# Altium project F4DroneFlightController.PrjPcb
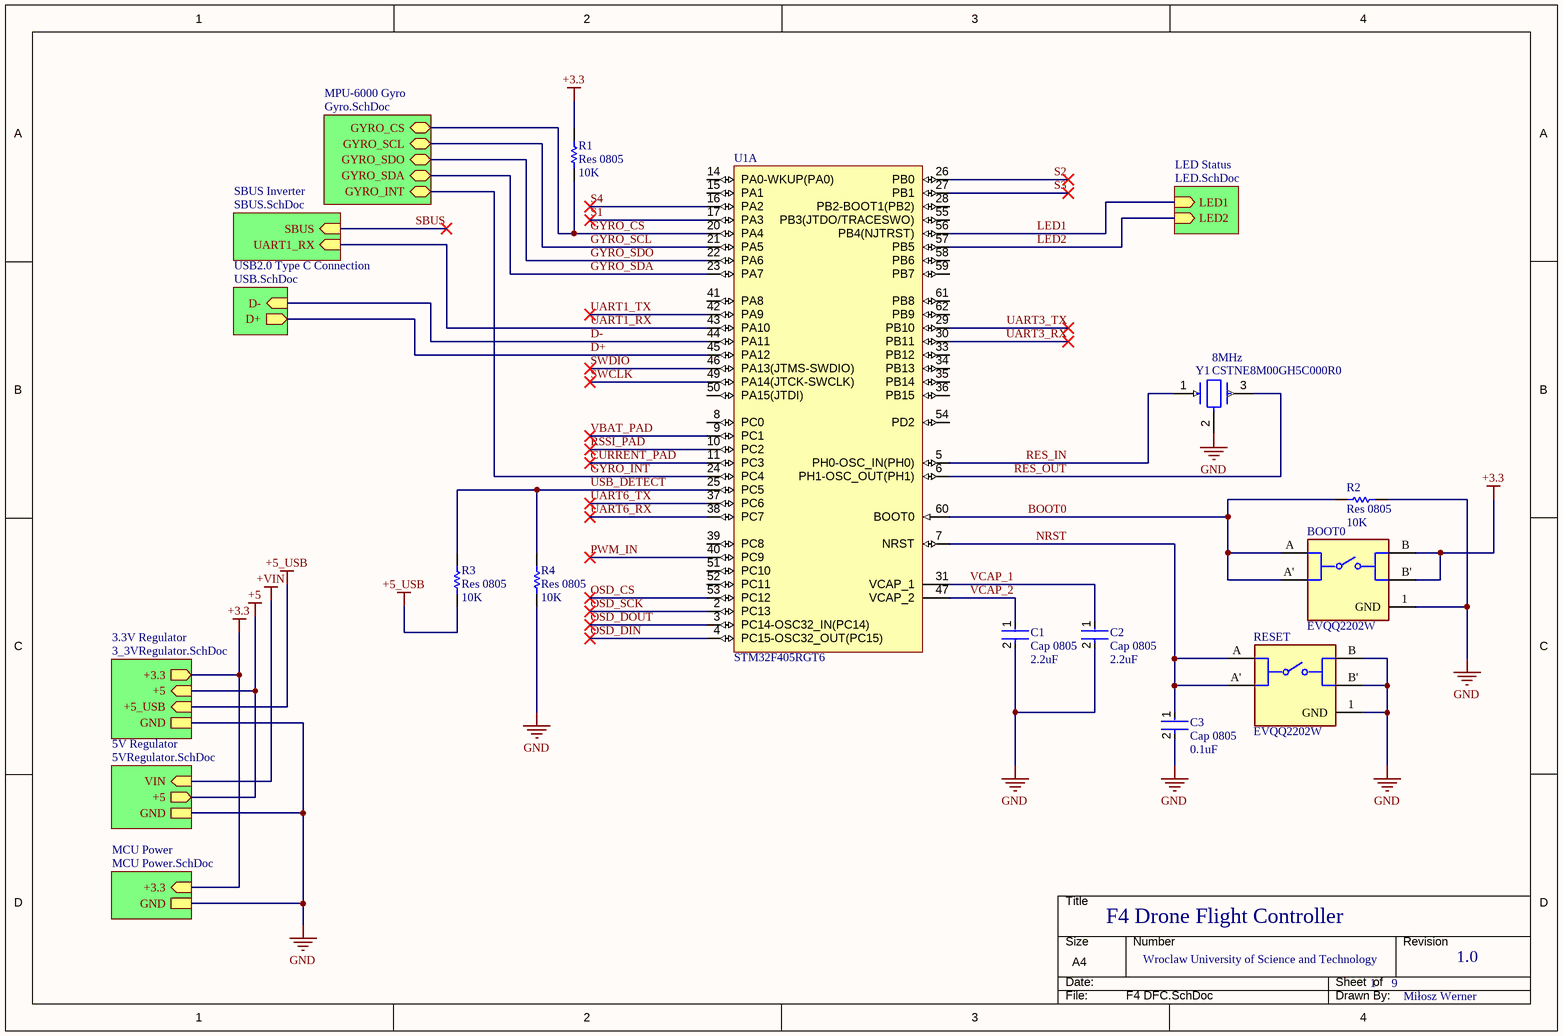
[diagram p0: F4 DFC.SchDoc]
9 sheets, 43 parts. Net scope: hierarchical (ports join the sheet entries above them; power ports are global).
Board file: PCB.PcbDoc
Sheets:
  F4 DFC.SchDoc
    MPU-6000 Gyro = Gyro.SchDoc
    LED Status = LED.SchDoc
    SBUS Inverter = SBUS.SchDoc
    USB2.0 Type C Connection = USB.SchDoc
    3.3V Regulator = 3_3VRegulator.SchDoc
    MCU Power = MCU Power.SchDoc
    5V Regulator = 5VRegulator.SchDoc
  SWD.SchDoc

## Sheet F4 DFC.SchDoc: F4 Drone Flight Controller
size A4; Author: Miłosz Werner & Julia Rzepka; DrawnBy: Miłosz Werner; Organization: Wroclaw University of Science and Technology; DocumentNumber: 1; Revision: 1.0; SheetNumber: 1; SheetTotal: 9

### Parts
BOOT0  EVQQ2202W  [FP-EVQQ2202W-MFG]
C1  Cap 0805  value 2.2uF  [FP-GRM216-0_1-IPC_C]
C2  Cap 0805  value 2.2uF  [FP-GRM216-0_1-IPC_C]
C3  Cap 0805  value 0.1uF  [FP-GRM216-0_1-IPC_C]
R1  Res 0805  value 10K  [RESC2013X50X30LL20T20]
R2  Res 0805  value 10K  [RESC2013X50X30LL20T20]
R3  Res 0805  value 10K  [RESC2013X50X30LL20T20]
R4  Res 0805  value 10K  [RESC2013X50X30LL20T20]
RESET  EVQQ2202W  [FP-EVQQ2202W-MFG]
U1  STM32F405RGT6  [STM-LQFP64_V]  (part A of 2)
Y1  CSTNE8M00GH5C000R0  value 8MHz  [FP-CSTNE8M00GH5C000R0-MFG]

### Sub-sheets
3.3V Regulator = 3_3VRegulator.SchDoc: +3.3 (out), +5 (in), +5_USB (in), GND
5V Regulator = 5VRegulator.SchDoc: VIN (in), +5 (out), GND
LED Status = LED.SchDoc: LED1 (in), LED2 (in)
MCU Power = MCU Power.SchDoc: +3.3 (in), GND
MPU-6000 Gyro = Gyro.SchDoc: GYRO_SDO (bidir), GYRO_SCL (bidir), GYRO_CS (bidir), GYRO_SDA (bidir), GYRO_INT (bidir)
SBUS Inverter = SBUS.SchDoc: UART1_RX (in), SBUS (in)
USB2.0 Type C Connection = USB.SchDoc: D- (in), D+ (out)

### Nets
+3.3: BOOT0.B BOOT0.B' R1.2 ; sheet 3.3V Regulator/+3.3, sheet MCU Power/+3.3
+5: sheet 3.3V Regulator/+5, sheet 5V Regulator/+5
+5_USB: R3.1 ; sheet 3.3V Regulator/+5_USB
+VIN: sheet 5V Regulator/VIN
GND: BOOT0.1(GND) C1.2 C2.2 C3.2 R2.1 R4.1 RESET.1(GND) RESET.B RESET.B' Y1.2(GND) ; sheet 3.3V Regulator/GND, sheet MCU Power/GND, sheet 5V Regulator/GND
BOOT0: BOOT0.A BOOT0.A' R2.2 U1.60(BOOT0)
CURRENT_PAD: U1.11(PC3)
D+: U1.45(PA12) ; sheet USB2.0 Type C Connection/D+
D-: U1.44(PA11) ; sheet USB2.0 Type C Connection/D-
GYRO_CS: R1.1 U1.20(PA4) ; sheet MPU-6000 Gyro/GYRO_CS
GYRO_INT: U1.24(PC4) ; sheet MPU-6000 Gyro/GYRO_INT
GYRO_SCL: U1.21(PA5) ; sheet MPU-6000 Gyro/GYRO_SCL
GYRO_SDA: U1.23(PA7) ; sheet MPU-6000 Gyro/GYRO_SDA
GYRO_SDO: U1.22(PA6) ; sheet MPU-6000 Gyro/GYRO_SDO
LED1: U1.56(PB4(NJTRST)) ; sheet LED Status/LED1
LED2: U1.57(PB5) ; sheet LED Status/LED2
NRST: C3.1 RESET.A RESET.A' U1.7(NRST)
OSD_CS: U1.53(PC12)
OSD_DIN: U1.4(PC15-OSC32_OUT(PC15))
OSD_DOUT: U1.3(PC14-OSC32_IN(PC14))
OSD_SCK: U1.2(PC13)
PWM_IN: U1.40(PC9)
RES_IN: U1.5(PH0-OSC_IN(PH0)) Y1.1(Input)
RES_OUT: U1.6(PH1-OSC_OUT(PH1)) Y1.3(Output)
RSSI_PAD: U1.10(PC2)
S1: U1.17(PA3)
S2: U1.26(PB0)
S3: U1.27(PB1)
S4: U1.16(PA2)
SWCLK: U1.49(PA14(JTCK-SWCLK))
SWDIO: U1.46(PA13(JTMS-SWDIO))
UART1_RX: U1.43(PA10) ; sheet SBUS Inverter/UART1_RX
UART1_TX: U1.42(PA9)
UART3_RX: U1.30(PB11)
UART3_TX: U1.29(PB10)
UART6_RX: U1.38(PC7)
UART6_TX: U1.37(PC6)
USB_DETECT: R3.2 R4.2 U1.25(PC5)
VBAT_PAD: U1.9(PC1)
VCAP_1: C2.1 U1.31(VCAP_1)
VCAP_2: C1.1 U1.47(VCAP_2)

Not connected (* = marked no-connect by the designer): U1 8(PC0) 14(PA0-WKUP(PA0)) 15(PA1) 28(PB2-BOOT1(PB2)) 33(PB12) 34(PB13) 35(PB14) 36(PB15) 39(PC8) 41(PA8) 50(PA15(JTDI)) 51(PC10) 52(PC11) 54(PD2) 55(PB3(JTDO/TRACESWO)) 58(PB6) 59(PB7) 61(PB8) 62(PB9)

### Notes on the sheet
- DWG. NO.
- REV.
- SHT.
- REVISION
- DESCRIPTION
- DATE
- APPROVED
- THIS DOCUMENT AND THE DATA DISCLOSED HEREIN OR HEREWITH IS THE PROPERTY OF ALTIUM LIMITED AND MAY BE FREELY DISTRIBUTED IN WHOLE. NO RIGHTS ARE RESERVED OR EXPRESS OR IMPLIED WARANTEE GIVEN.
- ENG:
- DSN:
- APPROVALS
- PROJECT
- DOCUMENT REVISION:
- DESIGN ITEM:
- CHK:
- BOM:
- REFERENCE DOCUMENTS
- PROJECT REVISION:
- TITLE
- FAB DWG:
- PCB DWG:
- ASSY DWG:
- SCALE:
- SIZE
- C
- CAGE CODE
- FILE NAME
- DWG NO.
- SHEET
- OF
- REV

### Library data of the parts
BOOT0 RESET = CMP-05618-000131-1: SWITCH TACTILE SPST-NO 0.02A 15V; Mechanical Life: 100000Cycles; Actuator Length: 0.7mm; Operating Force: 3.5N; Contact Current Rating: 20mA; Actuator Type: Standard; Illumination Type: Non-Illuminated; Contact Resistance: 100mR; Switch Travel: 0.25mm; Actuator Color: White; Voltage Rating (AC): 250V; Body Depth: 6mm; Throw Configuration: SPST; Switch Function: Off-Mom; REACH SVHC: No SVHC; RoHS Compliant: Yes; Color: White; Radiation Hardening: No; Series: EVQQ2; Max Operating Temperature: 85°C; Thickness: 1.8mm; Lead Free: Lead Free; Electrical Life: 100000Cycles; Packaging: Tape and Reel; Max Voltage Rating (DC): 15V; Contact Plating: Silver; Length: 6mm; Mount: Surface Mount; Depth: 6.6mm; Current Rating: 20mA; Min Operating Temperature: -40°C; Voltage Rating (DC): 15V; Size: 1.8mm; Termination: SMD/SMT; Case/Package: SMD/SMT; Max Voltage Rating (AC): 250V; Orientation: Straight; Package Quantity: 1; Max Current Rating: 20mA
C1-C3 = CMP-2007-00889-2: Capacitor; Capacitance: 100nF; Mount: Surface Mount; Case/Package: 0805; Case Code (Imperial): 0805
R1-R4 = CMP-2001-03735-1: Resistor
U1 = CMP-0243-00019-3: ARM Cortex-M4 32-bit MCU+FPU, 210 DMIPS, 1024 kB Flash, 192 kB Internal RAM, 51 I/Os, 64-pin LQFP, -40 to 85 degC, Tray; Manufacturer: STMicroelectronics; Supply Voltage(Vcc) min (V): 1.8; Supply Voltage(Vcc) max (V): 3.6; Internal RAM Size (kB): 192; I/Os (High Current): 51; D/A Converter: 2x12-bit; FLASH Size (Prog) (kB): 1024; Operating Frequency(F) (Processor speed) (MHz): 168; ComponentLink2Description: Datasheet; PackageVersion: Rev. 4, 06/2013; DatasheetVersion: Rev. 4; Core: ARM Cortex-M4; ComponentLink2URL: http://www.st.com/st-web-ui/static/active/en/resource/technical/document/datasheet/DM00037051.pdf; PackageReference: LQFP64; Packing: Tray; ComponentLink1Description: Manufacturer URL; ComponentLink3URL: http://www.st.com/st-web-ui/static/active/en/resource/technical/document/datasheet/DM00037051.pdf; ComponentLink3Description: Package Specification; Mounting Technology: Surface Mount; ComponentLink1URL: http://www.st.com/web/en/home.html; PackageDescription: 64-Pin Low Profile Quad Flat Package, 10 x 10 mm Body, 0.5 mm Pitch; PartNumber: STM32F405RGT6
Y1 = CMP-06057-000001-1: CERAMIC RES 8.0000MHZ 33PF SMD; Frequency Stability: 0.13%; Frequency Tolerance: 0.07%; Impedance: 40R; Mount: Surface Mount; Min Operating Temperature: -40°C; Max Operating Temperature: 125°C; Resistor Type: Ceramic; Capacitance: 33pF; Packaging: Tape and Reel; Frequency: 8MHz; Case/Package: SMD/SMT

## Sheet Gyro.SchDoc: MPU-6000 Gyro
size A4; Author: Miłosz Werner & Julia Rzepka; DrawnBy: Miłosz Werner; Organization: Wroclaw University of Science and Technology; DocumentNumber: 1; Revision: 1.0; SheetNumber: 2; SheetTotal: 9
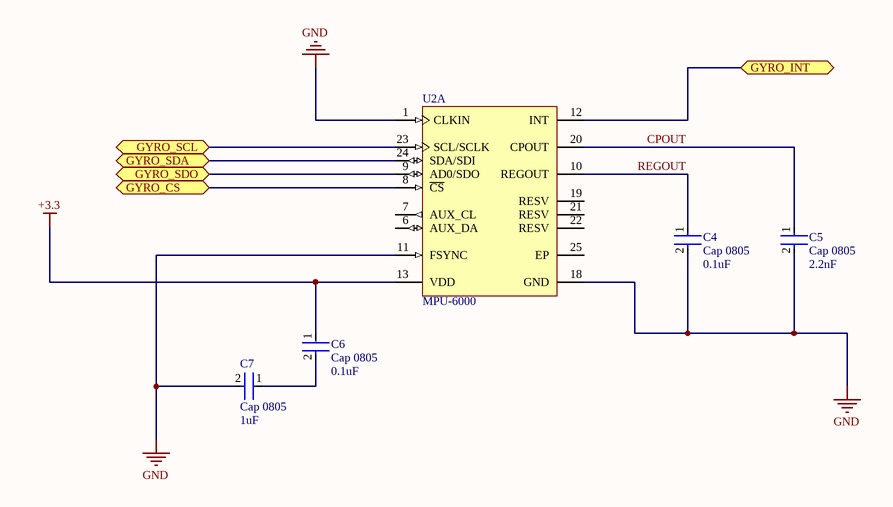
[diagram p1: Gyro.SchDoc]

### Parts
C4  Cap 0805  value 0.1uF  [FP-GRM216-0_1-IPC_C]
C5  Cap 0805  value 2.2nF  [FP-GRM216-0_1-IPC_C]
C6  Cap 0805  value 0.1uF  [FP-GRM216-0_1-IPC_C]
C7  Cap 0805  value 1uF  [FP-GRM216-0_1-IPC_C]
U2  MPU-6000  [INSE-QFN-24_V]  (part A of 2)

### Ports
GYRO_CS (bidir), GYRO_INT (bidir), GYRO_SCL (bidir), GYRO_SDA (bidir), GYRO_SDO (bidir)

### Nets
+3.3: C6.1 U2.13(VDD)
GND: C4.2 C5.2 C7.2 U2.1(CLKIN) U2.11(FSYNC) U2.18(GND)
CPOUT: C5.1 U2.20(CPOUT)
GYRO_CS: U2.8(~{CS}) ; port GYRO_CS
GYRO_INT: U2.12(INT) ; port GYRO_INT
GYRO_SCL: U2.23(SCL/SCLK) ; port GYRO_SCL
GYRO_SDA: U2.24(SDA/SDI) ; port GYRO_SDA
GYRO_SDO: U2.9(AD0/SDO) ; port GYRO_SDO
REGOUT: C4.1 U2.10(REGOUT)
NetC6_2: C6.2 C7.1

Not connected (* = marked no-connect by the designer): U2 6(AUX_DA) 7(AUX_CL) 19(RESV) 21(RESV) 22(RESV) 25(EP)

### Library data of the parts
C4-C7 = CMP-2007-00889-2: Capacitor; Capacitance: 100nF; Mount: Surface Mount; Case/Package: 0805; Case Code (Imperial): 0805
U2 = CMP-2000-05008-1: 3-Axis Gyroscope 3-Axis Accelerometer Motion Processing Unit with I2C and SPI, 2.5, 3 or 3.3 V, -40 to 85 degC, 24-Pin QFN, RoHS, Tape and Reel; Manufacturer: InvenSense; Featured Product: MPU60006AxisIntegratedSPISolution; Output Type: I²C,SPI; Sensor Type: Accelerometer,Gyroscope,3Axis; Other Names: 1428-1005-2 / MPU6000; Online Catalog: MPU-6000™Series; Operating Temperature: -40degC~85degC(TA); Datasheet URL: https://www.invensense.com/wp-content/uploads/2015/02/MPU-6000-Datasheet1.pdf; Manufacturer URL: http://www.invensense.com/; Datasheet Version: Rev. 3.4, 08/2013; Standard Package: 5,000; Family: Multifunction; Package Reference: QFN-24; Category: Sensors,Transducers; Package Description: 24-Pin Quad Flat No-lead Package, Body 4 x 4 mm, Pitch 0.5 mm

## Sheet LED.SchDoc: LED Status
size A4; Author: Miłosz Werner & Julia Rzepka; DrawnBy: Miłosz Werner; Organization: Wroclaw University of Science and Technology; Revision: 1.0; SheetNumber: 6; SheetTotal: 8
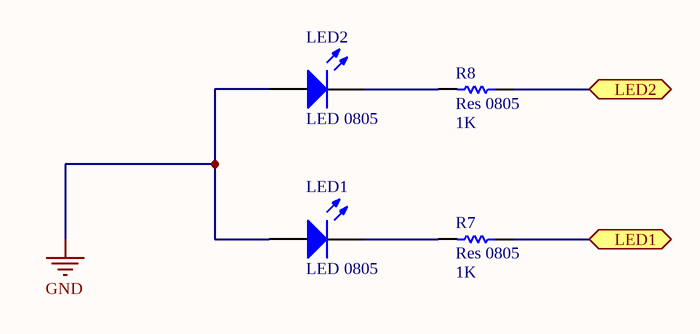
[diagram p2: LED.SchDoc]

### Parts
LED1  LED 0805  [0805_A]
LED2  LED 0805  [0805_A]
R7  Res 0805  value 1K  [RESC2013X50X30LL20T20]
R8  Res 0805  value 1K  [RESC2013X50X30LL20T20]

### Ports
LED1 (bidir), LED2 (bidir)

### Nets
GND: LED1.2(A) LED2.2(A)
LED1: R7.1 ; port LED1
LED2: R8.1 ; port LED2
NetLED1_1: LED1.1(K) R7.2
NetLED2_1: LED2.1(K) R8.2

### Library data of the parts
LED1 LED2 = CMP-1426-00010-1: LED; Manufacturer: Wuerth Elektronik; PartNumber: 150080SS75000; Color: Super Red; PackageReference: 0805_A; ComponentLink2URL: http://katalog.we-online.com/led/datasheet/150080SS75000.pdf; ComponentLink1URL: http://www.we-online.com; ComponentLink2Description: Datasheet; ComponentLink1Description: Manufacturer URL
R7 R8 = CMP-2001-03735-1: Resistor

## Sheet SBUS.SchDoc: SBUS Inverter
size A4; Author: Miłosz Werner & Julia Rzepka; DrawnBy: Miłosz Werner; Organization: Wroclaw University of Science and Technology; Revision: 1.0; SheetNumber: 4; SheetTotal: 8
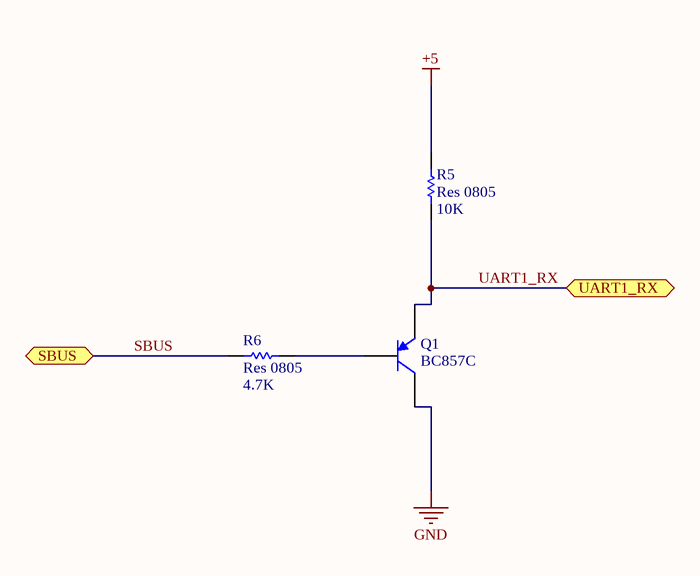
[diagram p3: SBUS.SchDoc]

### Parts
Q1  BC857C  [INF-SOT23_N]
R5  Res 0805  value 10K  [RESC2013X50X30LL20T20]
R6  Res 0805  value 4.7K  [RESC2013X50X30LL20T20]

### Ports
SBUS (bidir), UART1_RX (bidir)

### Nets
+5: R5.2
GND: Q1.3(C)
SBUS: R6.2 ; port SBUS
UART1_RX: Q1.2(E) R5.1 ; port UART1_RX
NetQ1_1: Q1.1(B) R6.1

### Library data of the parts
Q1 = CMP-1177-00039-1: PNP Silicon AF Transistor, 45 V VCEO, 100 mA IC, SOT23, Reel, Green; Manufacturer: Infineon; VCBO (max): 50Â V; fT (typ): 250Â MHz; ICBO (max): 15Â nA; IC (max): 100Â mA; Green: TRUE; IBM (max): 200Â mA; VEBO (max): 5Â V; VCEO (max): 45Â V; Ptot (max): 330Â mW; PackageDescription: 3-Pin Small Outline Transistor Package, 1.3 x 2.9 mm Body, 0.95 mm Pitch; ComponentLink2Description: Datasheet; PackageReference: SOT23; ComponentLink3Description: Package Specification; ComponentLink1URL: http://www.infineon.com/; ComponentLink1Description: Manufacturer URL; Mounting Technology: Surface Mount; PackageVersion: Apr-08; ComponentLink3URL: http://www.infineon.com/dgdl/SOT23-Package_Overview.pdf?folderId=db3a30431936bc4b0119532290053c66&fileId=db3a30431936bc4b0119533468123c85; ComponentLink2URL: http://www.infineon.com/dgdl/bc857series_bc858series_bc859series_bc860series.pdf?folderId=db3a304314dca389011541d30fa21656&fileId=db3a304314dca389011541da0e3a1661; Polarity: PNP; ICM (max): 200Â mA; PartNumber: BC857C; Packing: Reel
R5 R6 = CMP-2001-03735-1: Resistor

## Sheet USB.SchDoc: USB2.0 Type C Connection
size A4; Author: Miłosz Werner & Julia Rzepka; DrawnBy: Miłosz Werner; Organization: Wroclaw University of Science and Technology; Revision: 1.0; SheetNumber: 8; SheetTotal: 8
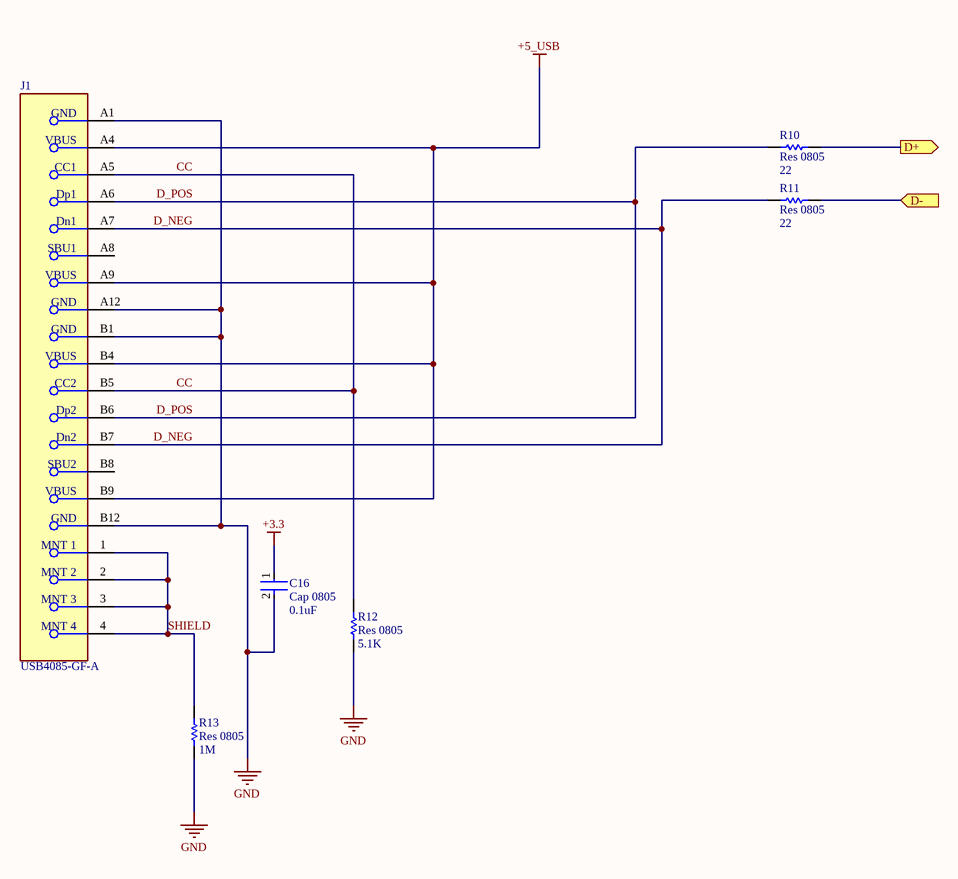
[diagram p4: USB.SchDoc]

### Parts
C16  Cap 0805  value 0.1uF  [FP-GRM216-0_1-IPC_C]
J1  USB4085-GF-A  [FP-USB4085-GF-A-MFG]
R10  Res 0805  value 22  [RESC2013X50X30LL20T20]
R11  Res 0805  value 22  [RESC2013X50X30LL20T20]
R12  Res 0805  value 5.1K  [RESC2013X50X30LL20T20]
R13  Res 0805  value 1M  [RESC2013X50X30LL20T20]

### Ports
D+ (out), D- (in)

### Nets
+3.3: C16.1
+5_USB: J1.A4(VBUS) J1.A9(VBUS) J1.B4(VBUS) J1.B9(VBUS)
GND: C16.2 J1.A1(GND) J1.A12(GND) J1.B1(GND) J1.B12(GND) R12.2 R13.2
CC: J1.A5(CC1) J1.B5(CC2) R12.1
D+: R10.1 ; port D+
D-: R11.1 ; port D-
D_NEG: J1.A7(Dn1) J1.B7(Dn2) R11.2
D_POS: J1.A6(Dp1) J1.B6(Dp2) R10.2
SHIELD: J1.1(MNT_1) J1.2(MNT_2) J1.3(MNT_3) J1.4(MNT_4) R13.1

Not connected (* = marked no-connect by the designer): J1 A8(SBU1) B8(SBU2)

### Library data of the parts
C16 = CMP-2007-00889-2: Capacitor; Capacitance: 100nF; Mount: Surface Mount; Case/Package: 0805; Case Code (Imperial): 0805
J1 = CMP-196119-000001-1: CONN RCPT USB2.0 TYPEC 16POS; Manufacturer: Global Connector Technology; Voltage Rating: 20V; Conn Orientation: Right Angle; Shielding: true; Current Rating: 4.25A; Number Of Contacts: 16; Pitch: 0.85mm; Is Female: yes; ComponentLink2URL: https://gct.co/files/drawings/usb4085.pdf; Category: Conn; Automotive: No; ComponentLink2Description: Datasheet; Height: 3.66mm; Manufacturer Part Number: USB4085-GF-A; Package: 0; Usb Standard: USB 2.0; Octopart: https://octopart.com/usb4085-gf-a-global+connector+technology-94773699; Device Class L3: unset; Digikey Description: CONN RCPT USB2.0 TYPEC 16POS; Temperature Range Low: -40°C; Temperature: -40°C to +85°C; Lead Free: Yes; Contact Material: Gold,Nickel; Device Class L1: Connectors; Temperature Range High: +85°C; Device Class L2: USB Connectors; RoHS: TRUE
R10-R13 = CMP-2001-03735-1: Resistor

## Sheet 3_3VRegulator.SchDoc: 3.3V Regulator
size A4; Author: Miłosz Werner & Julia Rzepka; DrawnBy: Miłosz Werner; Organization: Wroclaw University of Science and Technology; Revision: 1.0; SheetNumber: 3; SheetTotal: 8
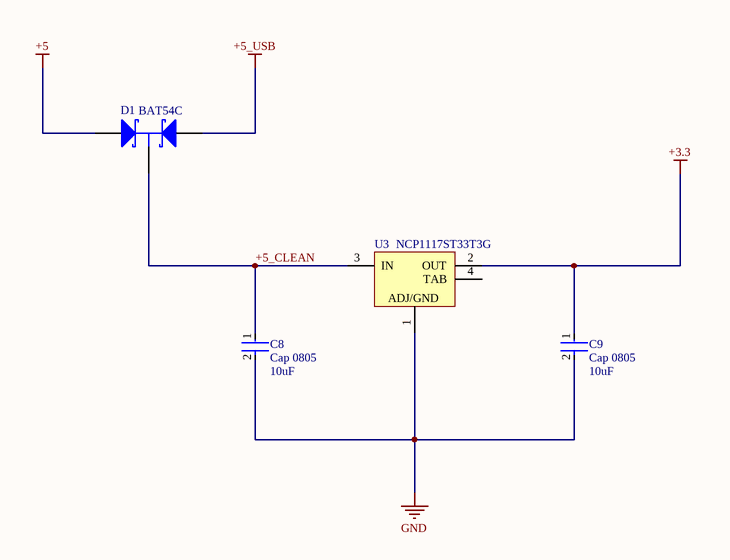
[diagram p5: 3_3VRegulator.SchDoc]

### Parts
C8  Cap 0805  value 10uF  [FP-GRM216-0_1-IPC_C]
C9  Cap 0805  value 10uF  [FP-GRM216-0_1-IPC_C]
D1  BAT54C  [NXP-SOT23-3_V]
U3  NCP1117ST33T3G  [ONSC-SOT-223-4-318H-01_A_V]

### Nets
+3.3: C9.1 U3.2(OUT)
+5: D1.2(A)
+5_USB: D1.1(A)
GND: C8.2 C9.2 U3.1(ADJ/GND)
+5_CLEAN: C8.1 D1.3(K) U3.3(IN)

Not connected (* = marked no-connect by the designer): U3 4(TAB)

### Library data of the parts
C8 C9 = CMP-2007-00889-2: Capacitor; Capacitance: 100nF; Mount: Surface Mount; Case/Package: 0805; Case Code (Imperial): 0805
D1 = CMP-0417-00003-1: Schottky Barrier Diode, 30 V, 2 uA, -55 to 150 degC, 3-Pin SOT23, RoHS, Tape and Reel; Manufacturer: NXP Semiconductors; IR (uA): 2; VF (mV): 800; Trr (ns): 5; Cd (pF): 10; VR (V): 30; Rth(j-a) (K/W): 500; RoHS: TRUE; Packing: Tape and Reel; ComponentLink2URL: http://www.nxp.com/documents/data_sheet/BAT54_SER.pdf; PartNumber: BAT54C; ComponentLink2Description: Datasheet; Temperature Range: -55 to 150 degC; PackageReference: SOT23-3; PackageDescription: 3-Pin Plastic Surface-mounted Package, Body 1.3 x 2.9 mm, Pitch 0.95 mm; Mounting Technology: Surface Mount; ComponentLink1URL: http://www.nxp.com/; DatasheetVersion: Rev. 5; ComponentLink1Description: Manufacturer URL
U3 = CMP-1679-00010-1: Low-Dropout Positive Fixed Voltage Regulator, 1 A, 3.3 V Output Voltage, 0 to 125 degC, 4-Pin SOT-223 (318H-01), Pb-Free, Tape and Reel; Resistance: 220 kohm; Type (Resistor): Thick Film; Voltage Rating: 75 V; Tolerance: 1%; Case\Package: 0603; Power Rating: 100 mW; Width: 0.85 mm; Weight: 7.1E-05 oz; ComponentLink2URL: http://www.onsemi.com/pub_link/Collateral/NCP1117-D.PDF; RoHSCompliant: true; Height: 0.45 mm; PackageDescription: 4-Pin Small Outline Transistor, Body 6.5 x 3.5 mm, Pitch 2.3 mm; ComponentLink1Description: Manufacturer URL; ComponentLink1URL: http://www.onsemi.com/; PackageReference: SOT-223-4-318H-01_A; Max Operating Temperature: 155 degC; Packaging: Tape and Reel; REACH SVHC: Unknown; Length: 1.55 mm; Package Quantity: 5000; Radiation Hardening: No; Min Operating Temperature: -55 degC; DatasheetVersion: Rev. 27, 09/2014; Mount: Surface Mount; Case Code (Imperial): 0603; Case Code (Metric): 1608; ComponentLink2Description: Datasheet

## Sheet MCU Power.SchDoc: MCU Power
size A4; Author: Miłosz Werner & Julia Rzepka; DrawnBy: Miłosz Werner; Organization: Wroclaw University of Science and Technology; Revision: 1.0; SheetNumber: 5; SheetTotal: 8
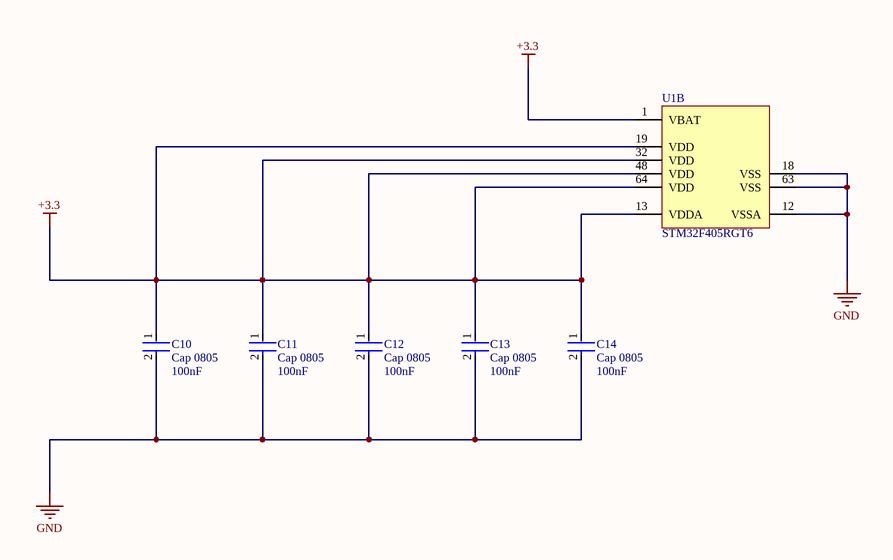
[diagram p6: MCU Power.SchDoc]

### Parts
C10  Cap 0805  value 100nF  [FP-GRM216-0_1-IPC_C]
C11  Cap 0805  value 100nF  [FP-GRM216-0_1-IPC_C]
C12  Cap 0805  value 100nF  [FP-GRM216-0_1-IPC_C]
C13  Cap 0805  value 100nF  [FP-GRM216-0_1-IPC_C]
C14  Cap 0805  value 100nF  [FP-GRM216-0_1-IPC_C]
U1  STM32F405RGT6  [STM-LQFP64_V]  (part B of 2)

### Nets
+3.3: C10.1 C11.1 C12.1 C13.1 C14.1 U1.1(VBAT) U1.13(VDDA) U1.19(VDD) U1.32(VDD) U1.48(VDD) U1.64(VDD)
GND: C10.2 C11.2 C12.2 C13.2 C14.2 U1.12(VSSA) U1.18(VSS) U1.63(VSS)

### Library data of the parts
C10-C14 = CMP-2007-00889-2: Capacitor; Mount: Surface Mount; Case/Package: 0805; Case Code (Imperial): 0805; Capacitance: 100nF
U1 = CMP-0243-00019-3: as U1 on sheet F4 DFC; ComponentLink2Description: Datasheet; PackageVersion: Rev. 4, 06/2013; DatasheetVersion: Rev. 4; Core: ARM Cortex-M4; ComponentLink2URL: http://www.st.com/st-web-ui/static/active/en/resource/technical/document/datasheet/DM00037051.pdf; PackageReference: LQFP64; Packing: Tray; ComponentLink1Description: Manufacturer URL; ComponentLink3URL: http://www.st.com/st-web-ui/static/active/en/resource/technical/document/datasheet/DM00037051.pdf; ComponentLink3Description: Package Specification; Mounting Technology: Surface Mount; ComponentLink1URL: http://www.st.com/web/en/home.html; PackageDescription: 64-Pin Low Profile Quad Flat Package, 10 x 10 mm Body, 0.5 mm Pitch; PartNumber: STM32F405RGT6

## Sheet 5VRegulator.SchDoc: 5V Regulator
size A4; Author: Miłosz Werner & Julia Rzepka; DrawnBy: Miłosz Werner; Organization: Wroclaw University of Science and Technology; Revision: 1.0; SheetNumber: 7; SheetTotal: 9
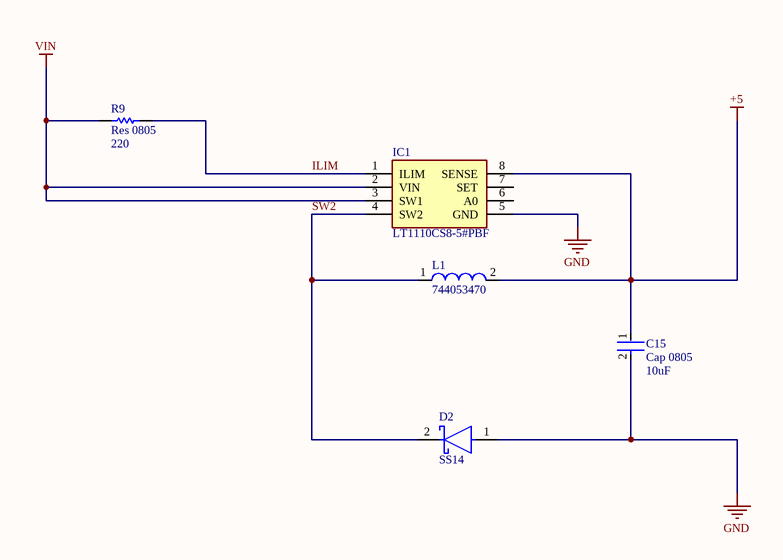
[diagram p7: 5VRegulator.SchDoc]

### Parts
C15  Cap 0805  value 10uF  [FP-GRM216-0_1-IPC_C]
D2  SS14  [FP-403AE-MFG]
IC1  LT1110CS8-5#PBF  [SOIC127P599X175-8N]
L1  744053470  [WE-TPC-5828-LH]
R9  Res 0805  value 220  [RESC2013X50X30LL20T20]

### Nets
+5: C15.1 IC1.8(SENSE) L1.2
GND: C15.2 D2.1(A) IC1.5(GND)
VIN: IC1.2(VIN) IC1.3(SW1) R9.2
ILIM: IC1.1(ILIM) R9.1
SW2: D2.2(C) IC1.4(SW2) L1.1

Not connected (* = marked no-connect by the designer): IC1 6(A0) 7(SET)

### Library data of the parts
C15 = CMP-2007-00889-2: Capacitor; Capacitance: 100nF; Mount: Surface Mount; Case/Package: 0805; Case Code (Imperial): 0805
D2 = CMP-2000-04943-2: DIODE SCHOTTKY 40V 1A SMA; Manufacturer: ON Semiconductor; Peak Reverse Current: 0.2mA; Max Junction Temp: +125°C; Standoff Height: 0.05mm; Max Surge Forward Current: 40A; Mouser Description: Schottky Diodes & Rectifiers SMA 40V 1.0A; RoHS: TRUE; Lead Free: Yes; Manufacturer Part Number: SS14; Device Class L3: Schottky Diodes; Category: Diode; Automotive: No; Digikey Description: DIODE SCHOTTKY 40V 1A SMA; ComponentLink2Description: Datasheet; Device Class L2: Diodes; Height: 2.5mm; Temperature Range High: +125°C; ComponentLink2URL: https://www.onsemi.com/pub/Collateral/SS19-D.PDF; Device Class L1: Discrete Semiconductors; Package: 403AE; Octopart: https://octopart.com/ss14-on+semiconductor-29205033; Max Repetitive Reverse Voltage: 40V; Temperature Range Low: -65°C; Forward Current: 1A; Temperature: -65°C to +125°C
IC1 = LT1110CS8#PBF: Conv DC-DC 1V to 30V Non-Inv/Inv/Step Up/Step Down Single-Out 5V Micropower 8-Pin SOIC N Tube; Manufacturer_Name: Linear Technology; Datasheet Link: https://www.analog.com/media/en/technical-documentation/data-sheets/lt1110.pdf; Height: 1.752mm; Manufacturer_Part_Number: LT1110CS8-5#PBF; Mouser Part Number: 584-LT1110CS8-5#PBF; Mouser Price/Stock: https://www.mouser.com/Search/Refine.aspx?Keyword=584-LT1110CS8%23PBF; Supplier 1: Mouser; Supplier Part Number 1: 584-LT1110CS8#PBF
L1 = CMP-0227-00413-1: SMD Shielded Tiny Power Inductor WE-TPC, L = 47.0 µH; Inductance: 47.0 ÂµH; PackageVersion: 2010; ComponentLink2Description: Datasheet; ComponentLink2URL: http://www.we-online.de/katalog/media/pdf/744053470.pdf; ComponentLink1Description: Manufacturer Link; PackageDescription: SMD Inductor, 2-Leads, Body 5.8 x 5.8 mm; DatasheetVersion: ver 6, Aug-2010; ComponentLink1URL: http://www.we-online.com; PackageReference: WE-TPC-5828-LH
R9 = CMP-2001-03735-1: Resistor

## Sheet SWD.SchDoc: SWD Connector
size A4; DrawnBy: Miłosz Werner; Organization: Wroclaw University of Science and Technology; Revision: 1.0; SheetNumber: 9; SheetTotal: 9

## Nets that join several sheets
+3.3: F4 DFC (BOOT0.B BOOT0.B' R1.2), Gyro (C6.1 U2.13), USB (C16.1), 3_3VRegulator (C9.1 U3.2), MCU Power (11 pins)
+5: SBUS (R5.2), 3_3VRegulator (D1.2), 5VRegulator (C15.1 IC1.8 L1.2)
+5_USB: F4 DFC (R3.1), USB (J1.A4 J1.A9 J1.B4 J1.B9), 3_3VRegulator (D1.1)
GND: F4 DFC (10 pins), Gyro (6 pins), LED (LED1.2 LED2.2), SBUS (Q1.3), USB (7 pins), 3_3VRegulator (C8.2 C9.2 U3.1), MCU Power (8 pins), 5VRegulator (C15.2 D2.1 IC1.5)
D+: F4 DFC (U1.45), USB (R10.1)
D-: F4 DFC (U1.44), USB (R11.1)
GYRO_CS: F4 DFC (R1.1 U1.20), Gyro (U2.8)
GYRO_INT: F4 DFC (U1.24), Gyro (U2.12)
GYRO_SCL: F4 DFC (U1.21), Gyro (U2.23)
GYRO_SDA: F4 DFC (U1.23), Gyro (U2.24)
GYRO_SDO: F4 DFC (U1.22), Gyro (U2.9)
LED1: F4 DFC (U1.56), LED (R7.1)
LED2: F4 DFC (U1.57), LED (R8.1)
UART1_RX: F4 DFC (U1.43), SBUS (Q1.2 R5.1)